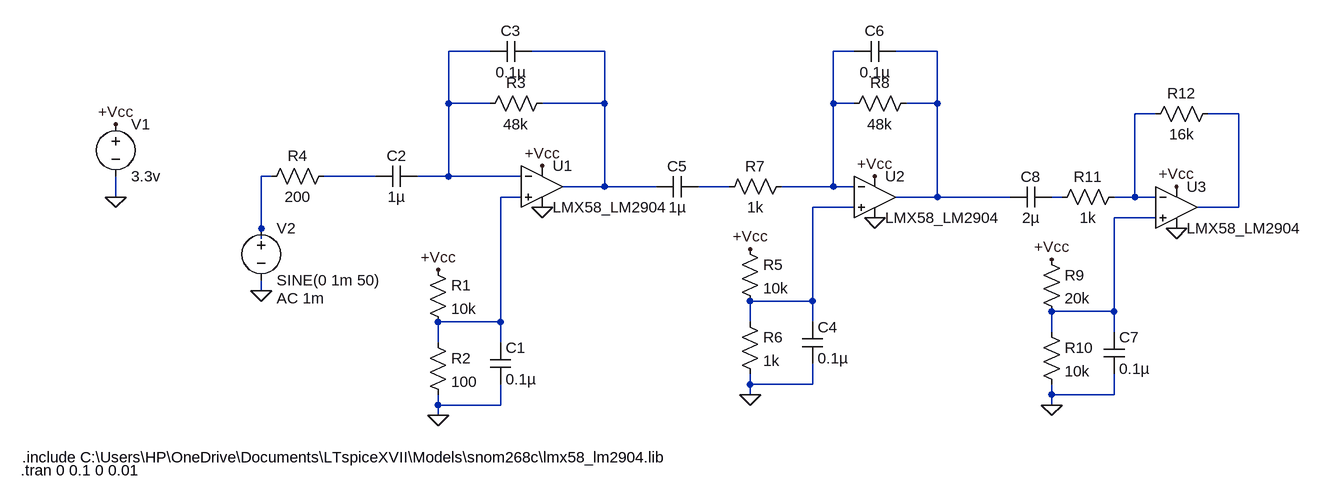
[diagram p0: schematic Preamp_v8.asc]
Preamp_v8.asc, the LTspice schematic file:
Version 4
SHEET 1 1564 680
WIRE 304 -64 240 -64
WIRE 480 -64 368 -64
WIRE 864 -64 832 -64
WIRE 992 -64 928 -64
WIRE 240 16 240 -64
WIRE 304 16 240 16
WIRE 480 16 480 -64
WIRE 480 16 384 16
WIRE 832 16 832 -64
WIRE 864 16 832 16
WIRE 992 16 992 -64
WIRE 992 16 944 16
WIRE 1328 32 1296 32
WIRE 1456 32 1408 32
WIRE -32 128 -48 128
WIRE 128 128 48 128
WIRE 240 128 240 16
WIRE 240 128 192 128
WIRE 352 128 240 128
WIRE 480 144 480 16
WIRE 480 144 416 144
WIRE 560 144 480 144
WIRE 672 144 624 144
WIRE 832 144 832 16
WIRE 832 144 752 144
WIRE 864 144 832 144
WIRE -272 160 -272 128
WIRE 352 160 320 160
WIRE 992 160 992 16
WIRE 992 160 928 160
WIRE 1104 160 992 160
WIRE 1184 160 1168 160
WIRE 1296 160 1296 32
WIRE 1296 160 1264 160
WIRE 1328 160 1296 160
WIRE 864 176 800 176
WIRE 1456 176 1456 32
WIRE 1456 176 1392 176
WIRE 1328 192 1264 192
WIRE -48 208 -48 128
WIRE -48 224 -48 208
WIRE -48 304 -48 288
WIRE 800 320 800 176
WIRE 800 320 704 320
WIRE 1264 336 1264 192
WIRE 1264 336 1168 336
WIRE 320 352 320 160
WIRE 320 352 224 352
WIRE 704 352 704 320
WIRE 800 352 800 320
WIRE 1168 368 1168 336
WIRE 1264 368 1264 336
WIRE 224 384 224 352
WIRE 320 384 320 352
WIRE 704 448 704 432
WIRE 800 448 800 416
WIRE 800 448 704 448
WIRE 704 464 704 448
WIRE 1168 464 1168 448
WIRE 1264 464 1264 432
WIRE 1264 464 1168 464
WIRE 224 480 224 464
WIRE 320 480 320 448
WIRE 320 480 224 480
WIRE 1168 480 1168 464
WIRE 224 496 224 480
FLAG -272 48 +Vcc
FLAG -272 160 0
FLAG 384 112 +Vcc
FLAG 384 176 0
FLAG 224 496 0
FLAG 224 272 +Vcc
FLAG -48 304 0
FLAG 896 128 +Vcc
FLAG 896 192 0
FLAG 704 464 0
FLAG 704 240 +Vcc
FLAG 1360 144 +Vcc
FLAG 1360 208 0
FLAG 1168 480 0
FLAG 1168 256 +Vcc
SYMBOL voltage -272 32 R0
WINDOW 123 0 0 Left 0
WINDOW 39 0 0 Left 0
SYMATTR InstName V1
SYMATTR Value 3.3v
SYMBOL OpAmps\\opamp2 384 80 R0
SYMATTR InstName U1
SYMATTR Value LMX58_LM2904
SYMBOL res 208 256 R0
SYMATTR InstName R1
SYMATTR Value 10k
SYMBOL res 208 368 R0
SYMATTR InstName R2
SYMATTR Value 100
SYMBOL cap 304 384 R0
SYMATTR InstName C1
SYMATTR Value 0.1µ
SYMBOL cap 192 112 R90
WINDOW 0 0 32 VBottom 2
WINDOW 3 32 32 VTop 2
SYMATTR InstName C2
SYMATTR Value 1µ
SYMBOL cap 368 -80 R90
WINDOW 0 0 32 VBottom 2
WINDOW 3 32 32 VTop 2
SYMATTR InstName C3
SYMATTR Value 0.1µ
SYMBOL res 400 0 R90
WINDOW 0 0 56 VBottom 2
WINDOW 3 32 56 VTop 2
SYMATTR InstName R3
SYMATTR Value 48k
SYMBOL voltage -48 192 R0
WINDOW 123 24 124 Left 2
WINDOW 39 0 0 Left 0
SYMATTR Value2 AC 1m
SYMATTR InstName V2
SYMATTR Value SINE(0 1m 50)
SYMBOL OpAmps\\opamp2 896 96 R0
SYMATTR InstName U2
SYMATTR Value LMX58_LM2904
SYMBOL res 64 112 R90
WINDOW 0 0 56 VBottom 2
WINDOW 3 32 56 VTop 2
SYMATTR InstName R4
SYMATTR Value 200
SYMBOL res 688 224 R0
SYMATTR InstName R5
SYMATTR Value 10k
SYMBOL res 688 336 R0
SYMATTR InstName R6
SYMATTR Value 1k
SYMBOL cap 784 352 R0
SYMATTR InstName C4
SYMATTR Value 0.1µ
SYMBOL cap 624 128 R90
WINDOW 0 0 32 VBottom 2
WINDOW 3 32 32 VTop 2
SYMATTR InstName C5
SYMATTR Value 1µ
SYMBOL res 960 0 R90
WINDOW 0 0 56 VBottom 2
WINDOW 3 32 56 VTop 2
SYMATTR InstName R8
SYMATTR Value 48k
SYMBOL cap 928 -80 R90
WINDOW 0 0 32 VBottom 2
WINDOW 3 32 32 VTop 2
SYMATTR InstName C6
SYMATTR Value 0.1µ
SYMBOL OpAmps\\opamp2 1360 112 R0
SYMATTR InstName U3
SYMATTR Value LMX58_LM2904
SYMBOL res 1152 240 R0
SYMATTR InstName R9
SYMATTR Value 20k
SYMBOL res 1152 352 R0
SYMATTR InstName R10
SYMATTR Value 10k
SYMBOL cap 1248 368 R0
SYMATTR InstName C7
SYMATTR Value 0.1µ
SYMBOL cap 1168 144 R90
WINDOW 0 0 32 VBottom 2
WINDOW 3 32 32 VTop 2
SYMATTR InstName C8
SYMATTR Value 2µ
SYMBOL res 1280 144 R90
WINDOW 0 0 56 VBottom 2
WINDOW 3 32 56 VTop 2
SYMATTR InstName R11
SYMATTR Value 1k
SYMBOL res 1424 16 R90
WINDOW 0 0 56 VBottom 2
WINDOW 3 32 56 VTop 2
SYMATTR InstName R12
SYMATTR Value 16k
SYMBOL res 768 128 R90
WINDOW 0 0 56 VBottom 2
WINDOW 3 32 56 VTop 2
SYMATTR InstName R7
SYMATTR Value 1k
TEXT -416 560 Left 2 !.include C:\\Users\\HP\\OneDrive\\Documents\\LTspiceXVII\\Models\\snom268c\\lmx58_lm2904.lib
TEXT -418 580 Left 2 !.tran 0 0.1 0 0.01

The netlist it stands for:
* Preamp_v8.asc
V1 +Vcc 0 3.3v
XU1 N010 N001 +Vcc 0 N002 LMX58_LM2904  ; pins In+ In- V+ V- OUT
R1 +Vcc N010 10k
R2 N010 0 100
C1 N010 0 0.1µ
C2 N001 N008 1µ
C3 N002 N001 0.1µ
R3 N002 N001 48k
V2 N007 0 SINE(0 1m 50) AC 1m
XU2 N012 N003 +Vcc 0 N004 LMX58_LM2904  ; pins In+ In- V+ V- OUT
R4 N008 N007 200
R5 +Vcc N012 10k
R6 N012 0 1k
C4 N012 0 0.1µ
C5 N009 N002 1µ
R8 N004 N003 48k
C6 N004 N003 0.1µ
XU3 N013 N005 +Vcc 0 N006 LMX58_LM2904  ; pins In+ In- V+ V- OUT
R9 +Vcc N013 20k
R10 N013 0 10k
C7 N013 0 0.1µ
C8 N011 N004 2µ
R11 N005 N011 1k
R12 N006 N005 16k
R7 N003 N009 1k
.include C:\Users\HP\OneDrive\Documents\LTspiceXVII\Models\snom268c\lmx58_lm2904.lib
.tran 0 0.1 0 0.01
.backanno
.end